# EasyEDA Pro project 2025-03-14.epro, board PCIex16_3
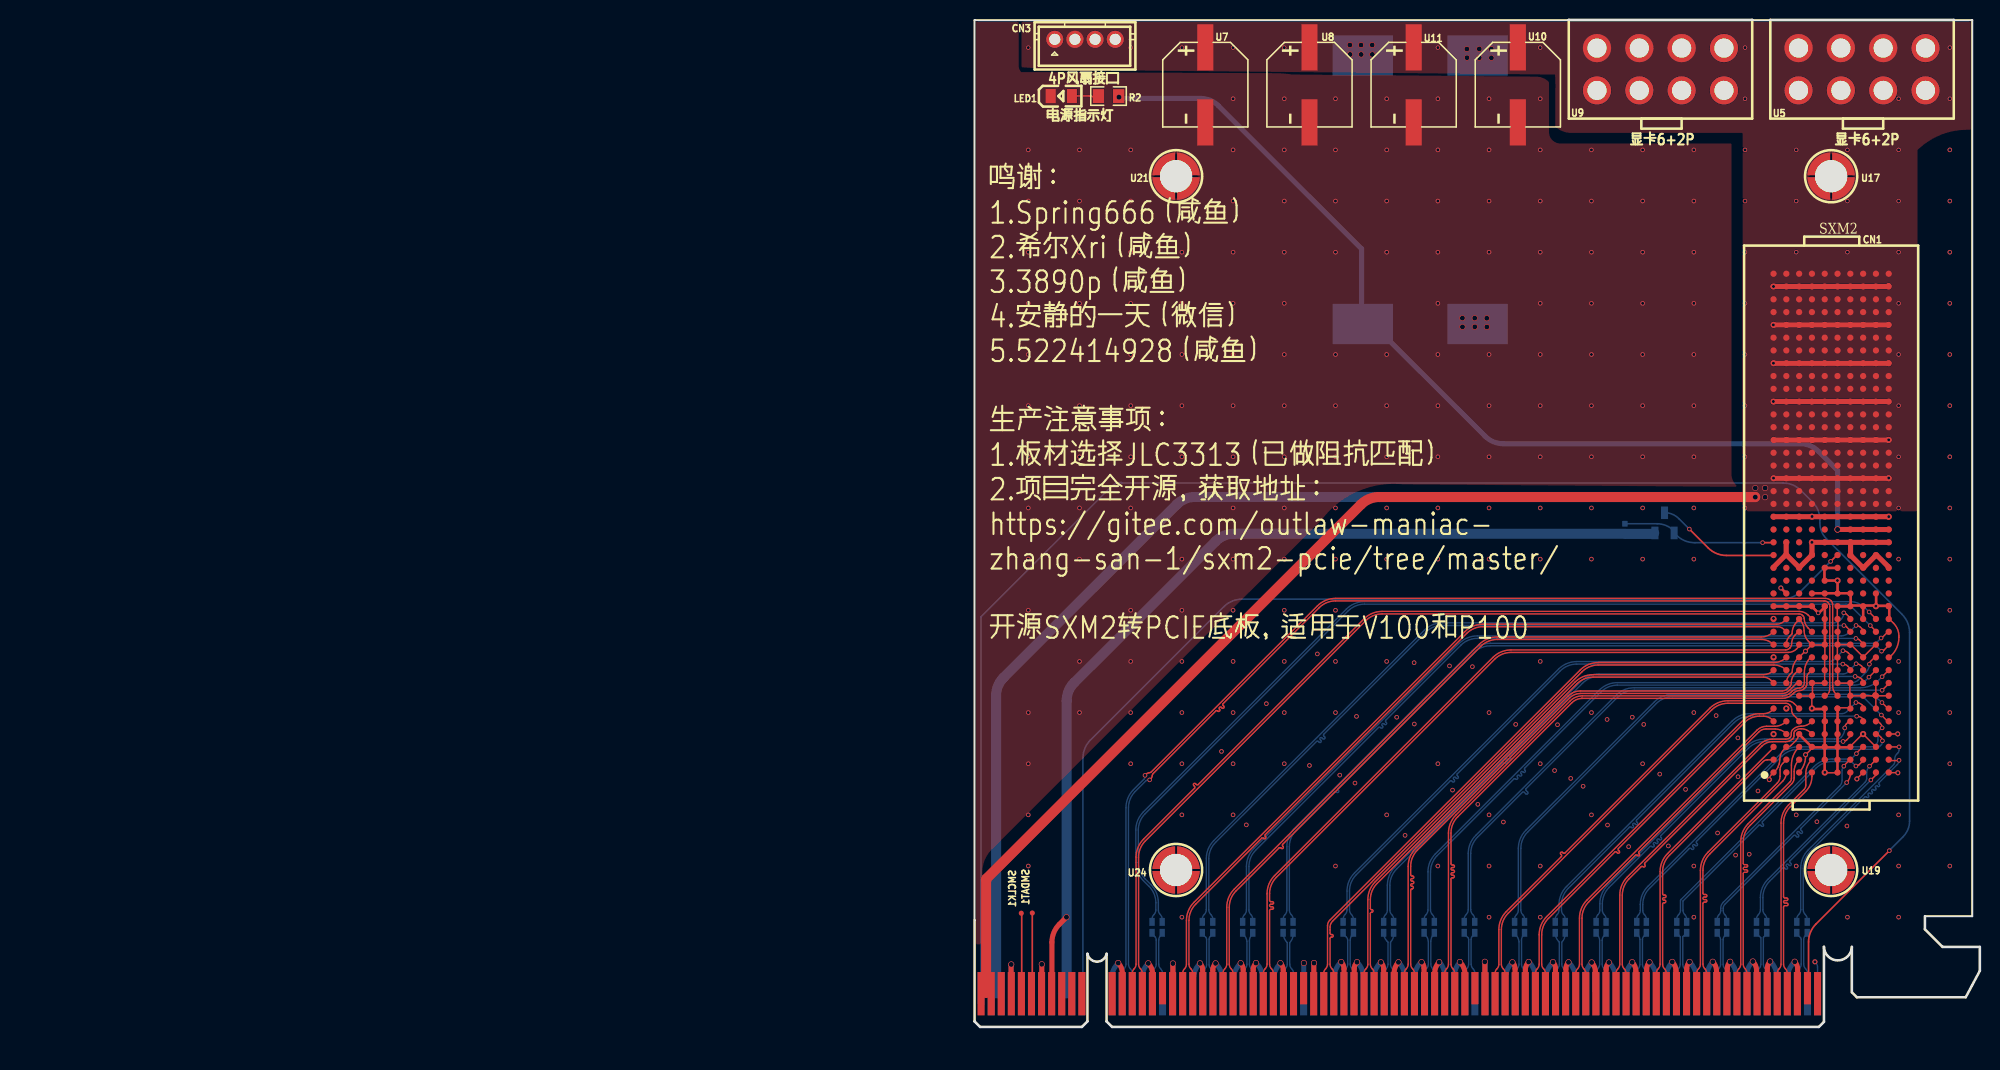
[diagram p1: board, top side]
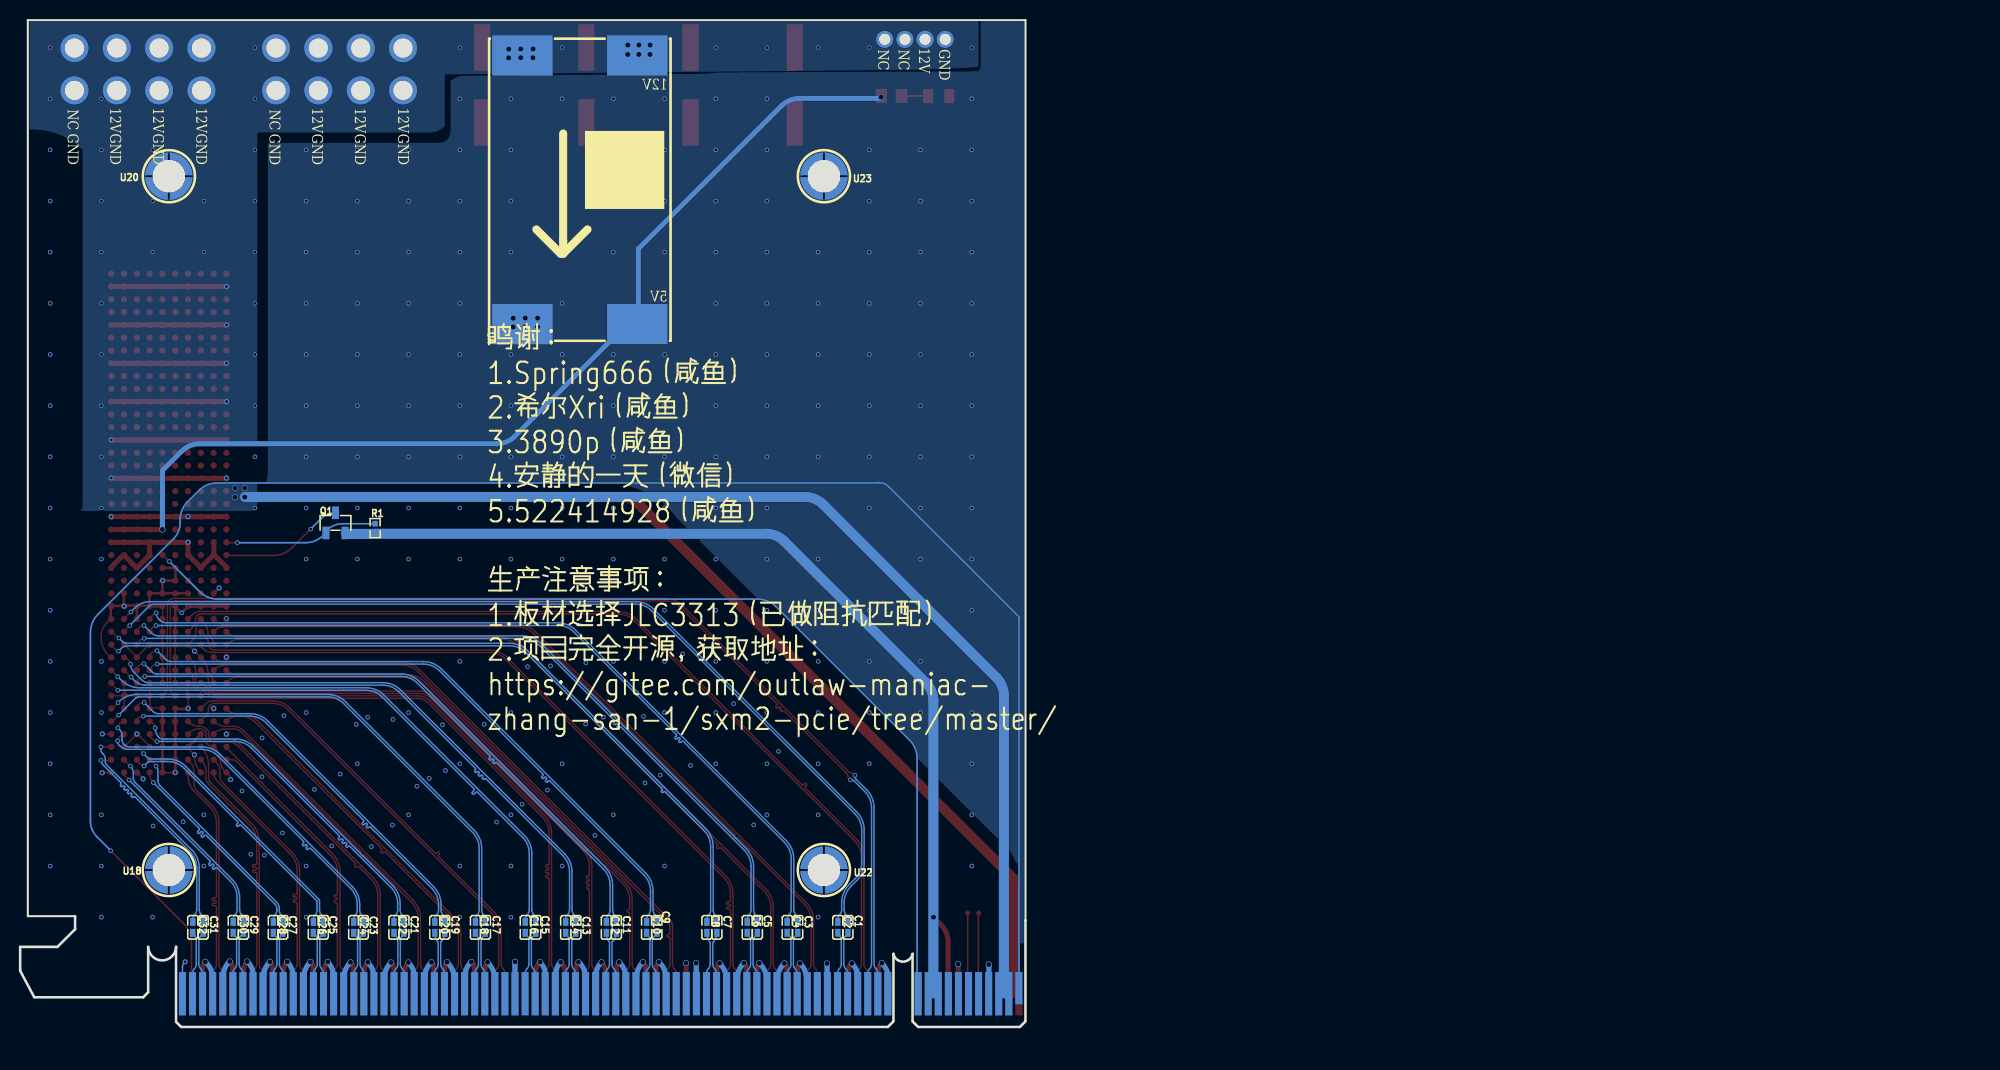
[diagram p2: board, bottom side, seen from below]

Outline 99.76 x 99.98 mm; copper layers: Top Layer, gnd1, gnd2, Bottom Layer. Coordinates in mm from the lower left corner of the outline.
Outline path: 0,10.63 0,99.98 99,99.98 99,11 94.31,11
Stack: Top Layer 0.035mm 外层铜厚1oz / Dielectric1 0.2104mm 7628 RC49% 8.6mil / gnd1 0.0152mm 内层铜厚 / Dielectric2 1.065mm 1.1mm H/HOZ Copper / gnd2 0.0152mm 内层铜厚 / Dielectric3 0.2104mm 7628 RC49% 8.6mil / Bottom Layer 0.035mm 外层铜厚1oz

## Design rules (mm)
net HSIP15_N: HSIP15_
net HSIP14_P: HSIP14_
net HSOP15_P: HSOP15_
net HSOP14_N: HSOP14_
net HSIP12_N: HSIP12_
net HSIP15_P: HSIP15_
net HSIP13_P: HSIP13_
net HSIP14_N: HSIP14_
net HSOP15_N: HSOP15_
net HSOP12_P: HSOP12_
net HSOP14_P: HSOP14_
net HSOP13_N: HSOP13_
net HSIP12_P: HSIP12_
net HSIP13_N: HSIP13_
net HSOP12_N: HSOP12_
net HSOP13_P: HSOP13_
net HSIP9_N: HSIP9_
net HSIP11_P: HSIP11_
net HSOP8_P: HSOP8_
net HSOP11_N: HSOP11_
net HSIP8_N: HSIP8_
net HSIP9_P: HSIP9_
net HSIP10_P: HSIP10_
net HSIP11_N: HSIP11_
net HSOP8_N: HSOP8_
net HSOP9_P: HSOP9_
net HSOP11_P: HSOP11_
net HSOP10_N: HSOP10_
net HSIP8_P: HSIP8_
net HSIP10_N: HSIP10_
net HSOP9_N: HSOP9_
net HSOP10_P: HSOP10_
net REFCLK_P: REFCLK_
net REFCLK_N: REFCLK_
net HSIP7_N: HSIP7_
net HSIP6_P: HSIP6_
net HSOP7_P: HSOP7_
net HSOP6_N: HSOP6_
net HSIP7_P: HSIP7_
net HSIP4_N: HSIP4_
net HSIP6_N: HSIP6_
net HSIP5_P: HSIP5_
net HSOP4_P: HSOP4_
net HSOP7_N: HSOP7_
net HSOP5_N: HSOP5_
net HSOP6_P: HSOP6_
net HSIP4_P: HSIP4_
net HSIP5_N: HSIP5_
net HSOP4_N: HSOP4_
net HSOP5_P: HSOP5_
net HSIP0_N: DP1
net HSIP3_P: HSIP3_
net HSOP1_P: HSOP1_
net HSOP3_N: HSOP3_
net HSIP0_P: DP1
net HSIP1_N: HSIP1_
net HSIP3_N: HSIP3_
net HSIP2_P: HSIP2_
net HSOP0_P: HSOP0_
net HSOP1_N: HSOP1_
net HSOP2_N: HSOP2_
net HSOP3_P: HSOP3_
net HSIP1_P: HSIP1_
net HSIP2_N: HSIP2_
net HSOP0_N: HSOP0_
net HSOP2_P: HSOP2_
net IP5+: IP5
net IP5-: IP5
net IP6+: IP6
net IP6-: IP6
net IP7-: IP7
net IP7+: IP7
net IP4-: IP4
net IP4+: IP4
net IP3-: IP3
net IP3+: IP3
net IP2-: IP2
net IP2+: IP2
net IP1-: IP1
net IP1+: IP1
net IP0-: IP0
net IP0+: IP0
net IP8+: IP8
net IP8-: IP8
net IP9+: IP9
net IP9-: IP9
net IP10+: IP10
net IP10-: IP10
net IP11+: IP11
net IP11-: IP11
net IP12+: IP12
net IP12-: IP12
net IP13+: IP13
net IP13-: IP13
net IP14+: IP14
net IP14-: IP14
net IP15+: IP15
net IP15-: IP15
template: 自定义配置
spacing copperThickness1oz (default): track to track 0.102, other pairs 0 to 2
track width 85ohm (default): min 0.127, default 0.254, max 1
track width 50ohm: min 0.16, default 0.16, max 1
track width power: min 0.5, default 0.5, max 2
track width def: min 0.127, default 0.14, max 2.54
differential pair 85ohm (default): width min 0.138, default 0.138, max 0.138; gap min 0.11, default 0.11
via viaSize (default): diameter min 0.45, default 0.45, max 10; hole min 0.3, default 0.3, max 6.299
net SMCLK uses 50ohm
net SMDAT uses 50ohm
net 12V uses power
net 12VGND uses def
net 5V uses power
net $1N108562 uses 50ohm
net PERST_N uses 50ohm
net $1N108568 uses 50ohm
net 3V3 uses power
net $1N101473 uses 50ohm
net $1N129529 uses 50ohm

## Placement (name value [footprint] x y rotation side)
C1  100nF  [C0402]  17.61 9.89 90 bottom
C2  100nF  [C0402]  18.62 9.89 90 bottom
C3  100nF  [C0402]  22.6 9.89 90 bottom
C4  100nF  [C0402]  23.64 9.89 90 bottom
C5  100nF  [C0402]  26.6 9.89 90 bottom
C6  100nF  [C0402]  27.61 9.89 90 bottom
C7  100nF  [C0402]  30.62 9.89 90 bottom
C8  100nF  [C0402]  31.61 9.89 90 bottom
C9  100nF  [C0402]  36.57 9.89 90 bottom
C10  100nF  [C0402]  37.6 9.89 90 bottom
C11  100nF  [C0402]  40.6 9.89 90 bottom
C12  100nF  [C0402]  41.59 9.89 90 bottom
C13  100nF  [C0402]  44.62 9.89 90 bottom
C14  100nF  [C0402]  45.63 9.89 90 bottom
C15  100nF  [C0402]  48.59 9.89 90 bottom
C16  100nF  [C0402]  49.63 9.89 90 bottom
C17  100nF  [C0402]  53.59 9.89 90 bottom
C18  100nF  [C0402]  54.58 9.89 90 bottom
C19  100nF  [C0402]  57.62 9.89 90 bottom
C20  100nF  [C0402]  58.61 9.89 90 bottom
C21  100nF  [C0402]  61.68 9.89 90 bottom
C22  100nF  [C0402]  62.67 9.89 90 bottom
C23  100nF  [C0402]  65.71 9.89 90 bottom
C24  100nF  [C0402]  66.66 9.89 90 bottom
C25  100nF  [C0402]  69.69 9.89 90 bottom
C26  100nF  [C0402]  70.66 9.89 90 bottom
C27  100nF  [C0402]  73.7 9.89 90 bottom
C28  100nF  [C0402]  74.63 9.89 90 bottom
C29  100nF  [C0402]  77.59 9.89 90 bottom
C30  100nF  [C0402]  78.62 9.89 90 bottom
C31  100nF  [C0402]  81.59 9.89 90 bottom
C32  100nF  [C0402]  82.63 9.89 90 bottom
CN1  84740-102LF  [CONN-SMD_400P-P1.27_84740-002LF]  85 50.04 270 top
CN3  WAFER-PH2.0-4PZZ  [CONN-TH_4P-P2.00_FWF20001-S04S22W5B]  10.96 98.08 0 top
J3  PCIEx16  [pciex16_金手指_有边框]  0.65 3.3 0 top
LED1  NCD0805R1  [LED0805-R-RD]  8.61 92.44 0 top
Q1  AO3400A  [SOT-23-3_L2.9-W1.3-P1.90-LS2.4-BR]  68.47 50.06 270 bottom
R1  10kΩ  [R0402]  64.54 49.54 270 bottom
R2  10kΩ  [R0805]  13.3 92.44 180 top
SMCLK1  -  [Test-Point-0.5mm]  4.64 11.29 90 bottom
SMDAT1  -  [Test-Point-0.5mm]  5.73 11.31 90 bottom
U4  mini5605V5A输出电源模块  [COMM-SMD_MINI5605V5A]  44.22 83.14 270 bottom
U5  显卡8P一体直针座黑色  [CONN-TH_5557-2-4P]  88.07 95.11 0 top
U7  16V470UF  [CAP-SMD_BD8.0-L8.3-W8.3-LS9.3-FD]  22.9 93.55 270 top
U8  16V470UF  [CAP-SMD_BD8.0-L8.3-W8.3-LS9.3-FD]  33.24 93.55 270 top
U9  显卡8P一体直针座黑色  [CONN-TH_5557-2-4P]  68.07 95.11 0 top
U10  16V470UF  [CAP-SMD_BD8.0-L8.3-W8.3-LS9.3-FD]  53.91 93.55 270 top
U11  16V470UF  [CAP-SMD_BD8.0-L8.3-W8.3-LS9.3-FD]  43.57 93.55 270 top
U17  铜柱M3*5+6  [SMD_BD4.2-L4.7-W4.7-D3.0]  85 84.48 0 top
U18  铜柱M3*5+6  [SMD_BD4.2-L4.7-W4.7-D3.0]  85 15.58 180 bottom
U19  铜柱M3*5+6  [SMD_BD4.2-L4.7-W4.7-D3.0]  85 15.58 0 top
U20  铜柱M3*5+6  [SMD_BD4.2-L4.7-W4.7-D3.0]  85 84.48 180 bottom
U21  铜柱M3*5+6  [SMD_BD4.2-L4.7-W4.7-D3.0]  20 84.48 0 top
U22  铜柱M3*5+6  [SMD_BD4.2-L4.7-W4.7-D3.0]  20 15.58 180 bottom
U23  铜柱M3*5+6  [SMD_BD4.2-L4.7-W4.7-D3.0]  20 84.48 180 bottom
U24  铜柱M3*5+6  [SMD_BD4.2-L4.7-W4.7-D3.0]  20 15.58 0 top

## Footprints (pads in the part's own frame, mm; a bottom-side part is the same pattern mirrored in y, then rotated)
C0402
  rect 0.79x0.54 smd: 1(-0.545,0) 2(0.545,0)
CAP-SMD_BD8.0-L8.3-W8.3-LS9.3-FD
  rect 4.6x1.6 smd: 1(-3.724,0) 2(3.724,0)
COMM-SMD_MINI5605V5A
  rect 4x6 smd: 1(-13.335,5.7) 2(-13.335,-5.7) 3(13.335,5.7) 4(13.335,-5.7)
CONN-SMD_400P-P1.27_84740-002LF
  round 0.623 smd: A1(24.765,-5.715) A2(23.495,-5.715) A3(22.225,-5.715) A4(20.955,-5.715) A5(19.685,-5.715) A6(18.415,-5.715) A8(15.875,-5.715) A9(14.605,-5.715) A10(13.335,-5.715) A11(12.065,-5.715) A12(10.795,-5.715) A13(9.525,-5.715) A14(8.255,-5.715) A15(6.985,-5.715) A16(5.715,-5.715) A17(4.445,-5.715) A18(3.175,-5.715) A19(1.905,-5.715) A20(0.635,-5.715) A21(-0.635,-5.715) A22(-1.905,-5.715) A23(-3.175,-5.715) A24(-4.445,-5.715) A25(-5.715,-5.715) A26(-6.985,-5.715) A27(-8.255,-5.715) A28(-9.525,-5.715) A29(-10.795,-5.715) A30(-12.065,-5.715) A31(-13.335,-5.715) A32(-14.605,-5.715) A33(-15.875,-5.715) A34(-17.145,-5.715) A35(-18.415,-5.715) A36(-19.685,-5.715) A37(-20.955,-5.715) A38(-22.225,-5.715) A39(-23.495,-5.715) A40(-24.765,-5.715) B1(24.765,-4.445) B2(23.495,-4.445) B3(22.225,-4.445) B4(20.955,-4.445) B5(19.685,-4.445) B6(18.415,-4.445) B8(15.875,-4.445) B9(14.605,-4.445) B10(13.335,-4.445) B11(12.065,-4.445) B12(10.795,-4.445) B13(9.525,-4.445) B14(8.255,-4.445) B15(6.985,-4.445) B16(5.715,-4.445) B17(4.445,-4.445) B18(3.175,-4.445) B19(1.905,-4.445) B20(0.635,-4.445) B21(-0.635,-4.445) B22(-1.905,-4.445) B23(-3.175,-4.445) B24(-4.445,-4.445) B25(-5.715,-4.445) B26(-6.985,-4.445) B27(-8.255,-4.445) B28(-9.525,-4.445) B29(-10.795,-4.445) B30(-12.065,-4.445) B31(-13.335,-4.445) B32(-14.605,-4.445) B33(-15.875,-4.445) B34(-17.145,-4.445) B35(-18.415,-4.445) B36(-19.685,-4.445) B37(-20.955,-4.445) B38(-22.225,-4.445) B39(-23.495,-4.445) B40(-24.765,-4.445) C1(24.765,-3.175) C2(23.495,-3.175) C3(22.225,-3.175) C4(20.955,-3.175) C5(19.685,-3.175) C6(18.415,-3.175) C7(17.145,-3.175) C8(15.875,-3.175) C9(14.605,-3.175) C10(13.335,-3.175) C11(12.065,-3.175) C12(10.795,-3.175) C13(9.525,-3.175) C14(8.255,-3.175) C15(6.985,-3.175) C16(5.715,-3.175) C17(4.445,-3.175) C18(3.175,-3.175) C19(1.905,-3.175) C20(0.635,-3.175) C21(-0.635,-3.175) C22(-1.905,-3.175) C23(-3.175,-3.175) C24(-4.445,-3.175) C25(-5.715,-3.175) C26(-6.985,-3.175) C27(-8.255,-3.175) C28(-9.525,-3.175) C29(-10.795,-3.175) C30(-12.065,-3.175) C31(-13.335,-3.175) C32(-14.605,-3.175) C33(-15.875,-3.175) C34(-17.145,-3.175) C35(-18.415,-3.175) C36(-19.685,-3.175) C37(-20.955,-3.175) C38(-22.225,-3.175) C39(-23.495,-3.175) C40(-24.765,-3.175) D1(24.765,-1.905) D2(23.495,-1.905) D3(22.225,-1.905) D4(20.955,-1.905) D5(19.685,-1.905) D6(18.415,-1.905) D7(17.145,-1.905) D8(15.875,-1.905) D9(14.605,-1.905) D10(13.335,-1.905) D11(12.065,-1.905) D12(10.795,-1.905) D13(9.525,-1.905) D14(8.255,-1.905) D15(6.985,-1.905) D16(5.715,-1.905) D17(4.445,-1.905) D18(3.175,-1.905) D19(1.905,-1.905) D20(0.635,-1.905) D21(-0.635,-1.905) D22(-1.905,-1.905) D23(-3.175,-1.905) D24(-4.445,-1.905) D25(-5.715,-1.905) D26(-6.985,-1.905) D27(-8.255,-1.905) D28(-9.525,-1.905) D29(-10.795,-1.905) D30(-12.065,-1.905) D31(-13.335,-1.905) D32(-14.605,-1.905) D33(-15.875,-1.905) D34(-17.145,-1.905) D35(-18.415,-1.905) D36(-19.685,-1.905) D37(-20.955,-1.905) D38(-22.225,-1.905) D39(-23.495,-1.905) D40(-24.765,-1.905) E1(24.765,-0.635) E2(23.495,-0.635) E3(22.225,-0.635) E4(20.955,-0.635) E5(19.685,-0.635) E6(18.415,-0.635) E7(17.145,-0.635) E8(15.875,-0.635) E9(14.605,-0.635) E10(13.335,-0.635) E11(12.065,-0.635) E12(10.795,-0.635) E13(9.525,-0.635) E14(8.255,-0.635) E15(6.985,-0.635) E16(5.715,-0.635) E17(4.445,-0.635) E18(3.175,-0.635) E19(1.905,-0.635) E20(0.635,-0.635) E21(-0.635,-0.635) E22(-1.905,-0.635) E23(-3.175,-0.635) E24(-4.445,-0.635) E25(-5.715,-0.635) E26(-6.985,-0.635) E27(-8.255,-0.635) E28(-9.525,-0.635) E29(-10.795,-0.635) E30(-12.065,-0.635) E31(-13.335,-0.635) E32(-14.605,-0.635) E33(-15.875,-0.635) E34(-17.145,-0.635) E35(-18.415,-0.635) E36(-19.685,-0.635) E37(-20.955,-0.635) E38(-22.225,-0.635) E39(-23.495,-0.635) E40(-24.765,-0.635) F1(24.765,0.635) F2(23.495,0.635) F3(22.225,0.635) F4(20.955,0.635) F5(19.685,0.635) F6(18.415,0.635) F7(17.145,0.635) F8(15.875,0.635) F9(14.605,0.635) F10(13.335,0.635) F11(12.065,0.635) F12(10.795,0.635) F13(9.525,0.635) F14(8.255,0.635) F15(6.985,0.635) F16(5.715,0.635) F17(4.445,0.635) F18(3.175,0.635) F19(1.905,0.635) F20(0.635,0.635) F21(-0.635,0.635) F22(-1.905,0.635) F23(-3.175,0.635) F24(-4.445,0.635) F25(-5.715,0.635) F26(-6.985,0.635) F27(-8.255,0.635) F28(-9.525,0.635) F29(-10.795,0.635) F30(-12.065,0.635) F31(-13.335,0.635) F32(-14.605,0.635) F33(-15.875,0.635) F34(-17.145,0.635) F35(-18.415,0.635) F36(-19.685,0.635) F37(-20.955,0.635) F38(-22.225,0.635) F39(-23.495,0.635) F40(-24.765,0.635) G1(24.765,1.905) G2(23.495,1.905) G3(22.225,1.905) G4(20.955,1.905) G5(19.685,1.905) G6(18.415,1.905) G7(17.145,1.905) G8(15.875,1.905) G9(14.605,1.905) G10(13.335,1.905) G11(12.065,1.905) G12(10.795,1.905) G13(9.525,1.905) G14(8.255,1.905) G15(6.985,1.905) G16(5.715,1.905) G17(4.445,1.905) G18(3.175,1.905) G19(1.905,1.905) G20(0.635,1.905) G21(-0.635,1.905) G22(-1.905,1.905) G23(-3.175,1.905) G24(-4.445,1.905) G25(-5.715,1.905) G26(-6.985,1.905) G27(-8.255,1.905) G28(-9.525,1.905) G29(-10.795,1.905) G30(-12.065,1.905) G31(-13.335,1.905) G32(-14.605,1.905) G33(-15.875,1.905) G34(-17.145,1.905) G35(-18.415,1.905) G36(-19.685,1.905) G37(-20.955,1.905) G38(-22.225,1.905) G39(-23.495,1.905) G40(-24.765,1.905) H1(24.765,3.175) H2(23.495,3.175) H3(22.225,3.175) H4(20.955,3.175) H5(19.685,3.175) H6(18.415,3.175) H7(17.145,3.175) H8(15.875,3.175) H9(14.605,3.175) H10(13.335,3.175) H11(12.065,3.175) H12(10.795,3.175) H13(9.525,3.175) H14(8.255,3.175) H15(6.985,3.175) H16(5.715,3.175) H17(4.445,3.175) H18(3.175,3.175) H19(1.905,3.175) H20(0.635,3.175) H21(-0.635,3.175) H22(-1.905,3.175) H23(-3.175,3.175) H24(-4.445,3.175) H25(-5.715,3.175) H26(-6.985,3.175) H27(-8.255,3.175) H28(-9.525,3.175) H29(-10.795,3.175) H30(-12.065,3.175) H31(-13.335,3.175) H32(-14.605,3.175) H33(-15.875,3.175) H34(-17.145,3.175) H35(-18.415,3.175) H36(-19.685,3.175) H37(-20.955,3.175) H38(-22.225,3.175) H39(-23.495,3.175) H40(-24.765,3.175) J1(24.765,4.445) J2(23.495,4.445) J3(22.225,4.445) J4(20.955,4.445) J5(19.685,4.445) J6(18.415,4.445) J7(17.145,4.445) J8(15.875,4.445) J9(14.605,4.445) J10(13.335,4.445) J11(12.065,4.445) J12(10.795,4.445) J13(9.525,4.445) J14(8.255,4.445) J15(6.985,4.445) J16(5.715,4.445) J17(4.445,4.445) J18(3.175,4.445) J19(1.905,4.445) J20(0.635,4.445) J21(-0.635,4.445) J22(-1.905,4.445) J23(-3.175,4.445) J24(-4.445,4.445) J25(-5.715,4.445) J26(-6.985,4.445) J27(-8.255,4.445) J28(-9.525,4.445) J29(-10.795,4.445) J30(-12.065,4.445) J31(-13.335,4.445) J32(-14.605,4.445) J33(-15.875,4.445) J34(-17.145,4.445) J35(-18.415,4.445) J36(-19.685,4.445) J37(-20.955,4.445) J38(-22.225,4.445) J39(-23.495,4.445) J40(-24.765,4.445) K1(24.765,5.715) K2(23.495,5.715) K3(22.225,5.715) K4(20.955,5.715) K5(19.685,5.715) K6(18.415,5.715) K7(17.145,5.715) K8(15.875,5.715) K9(14.605,5.715) K10(13.335,5.715) K11(12.065,5.715) K12(10.795,5.715) K13(9.525,5.715) K14(8.255,5.715) K15(6.985,5.715) K16(5.715,5.715) K17(4.445,5.715) K18(3.175,5.715) K19(1.905,5.715) K20(0.635,5.715) K21(-0.635,5.715) K22(-1.905,5.715) K23(-3.175,5.715) K24(-4.445,5.715) K25(-5.715,5.715) K26(-6.985,5.715) K27(-8.255,5.715) K28(-9.525,5.715) K29(-10.795,5.715) K30(-12.065,5.715) K31(-13.335,5.715) K32(-14.605,5.715) K33(-15.875,5.715) K34(-17.145,5.715) K35(-18.415,5.715) K36(-19.685,5.715) K37(-20.955,5.715) K38(-22.225,5.715) K39(-23.495,5.715) K40(-24.765,5.715)
CONN-TH_4P-P2.00_FWF20001-S04S22W5B
  round 1.7 hole 1.1: 1(-3,0) 2(-1,0) 3(1,0) 4(3,0)
CONN-TH_5557-2-4P
  round 2.8 hole 1.9: 1(-6.3,2.1) 2(-2.1,2.1) 3(2.1,2.1) 4(6.3,2.1) 5(6.3,-2.1) 6(2.1,-2.1) 7(-2.1,-2.1) 8(-6.3,-2.1)
LED0805-R-RD
  rect 1x1.399 smd: 1(1.05,0) 2(-1.05,0)
pciex16_金手指_有边框
  rect 0.7x3.2 smd far side: A1(0.001,0.55)
  rect 0.7x4.3 smd far side: A2(1,0) A3(2.001,0) A4(3,0) A5(4,0) A6(5,0) A7(6,0) A8(7,0) A9(8,0) A10(9,0) A11(10,0) A12(13,0) A13(14,0) A14(15,0) A15(16,0) A16(17,0) A17(18,0) A18(19,0) A19(20,0) A20(21,0) A21(22,0) A22(23,0) A23(24,0) A24(25,0) A25(26,0) A26(27,0) A27(28,0) A28(29,0) A29(30,0) A30(31,0) A31(32.001,0) A32(33.001,0) A33(34.001,0) A34(35.001,0) A35(36.001,0) A36(37,0) A37(38,0) A38(39.001,0) A39(40.001,0) A40(41.001,0) A41(42.001,0) A42(43.001,0) A43(44.001,0) A44(45,0) A45(46,0) A46(47,0) A47(48,0) A48(49,0) A49(50,0) A50(51.001,0) A51(52.001,0) A52(53.001,0) A53(54.001,0) A54(55.001,0) A55(56.001,0) A56(57.001,0) A57(58.001,0) A58(59.001,0) A59(60.001,0) A60(61.001,0) A61(62.001,0) A62(63.001,0) A63(64.001,0) A64(65,0) A65(66,0) A66(67,0) A67(68.001,0) A68(69.001,0) A69(70.001,0) A70(71.001,0) A71(72.001,0) A72(73.001,0) A73(74.001,0) A74(75.001,0) A75(76.001,0) A76(77.001,0) A77(78.001,0) A78(79.001,0) A79(80.001,0) A80(81.001,0) A81(82.001,0) A82(83,0)
  rect 0.7x4.3 smd: B1(0.001,0) B2(1,0) B3(2.001,0) B4(3,0) B5(4,0) B6(5,0) B7(6,0) B8(7,0) B9(8,0) B10(9,0) B11(10,0) B12(13,0) B13(14,0) B14(15,0) B15(16,0) B16(17,0) B18(19,0) B19(20,0) B20(21,0) B21(22,0) B22(23,0) B23(24,0) B24(25,0) B25(26,0) B26(27,0) B27(28,0) B28(29,0) B29(30,0) B30(31,0) B32(33.001,0) B33(34.001,0) B34(35.001,0) B35(36.001,0) B36(37,0) B37(38,0) B38(39.001,0) B39(40.001,0) B40(41.001,0) B41(42.001,0) B42(43.001,0) B43(44.001,0) B44(45,0) B45(46,0) B46(47,0) B47(48,0) B49(50,0) B50(51.001,0) B51(52.001,0) B52(53.001,0) B53(54.001,0) B54(55.001,0) B55(56.001,0) B56(57.001,0) B57(58.001,0) B58(59.001,0) B59(60.001,0) B60(61.001,0) B61(62.001,0) B62(63.001,0) B63(64.001,0) B64(65,0) B65(66,0) B66(67,0) B67(68.001,0) B68(69.001,0) B69(70.001,0) B70(71.001,0) B71(72.001,0) B72(73.001,0) B73(74.001,0) B74(75.001,0) B75(76.001,0) B76(77.001,0) B77(78.001,0) B78(79.001,0) B79(80.001,0) B80(81.001,0) B82(83,0)
  rect 0.7x3.2 smd: B17(18,0.55) B31(32.001,0.55) B48(49,0.55) B81(82.001,0.55)
R0402
  rect 0.566x0.54 smd: 1(-0.433,0) 2(0.433,0)
R0805
  rect 1.133x1.377 smd: 1(-1,0) 2(1,0)
SMD_BD4.2-L4.7-W4.7-D3.0
  custom 2.25x2.25 smd: 1(-1.225,1.443) 1(-1.225,-1.442) 1(1.225,1.443) 1(1.225,-1.443)
SOT-23-3_L2.9-W1.3-P1.90-LS2.4-BR
  rect 1.25x0.7 smd: 1(1,-0.95) 2(1,0.95) 3(-1,0)
Test-Point-0.5mm
  round 0.5 smd far side: 1(0,0)

## Nets
As in the schematic, except:
12VGND: CN1.A1 CN1.A4 CN1.A10 CN1.A13 CN1.A14 CN1.A17 CN1.A21 CN1.A24 CN1.A27 CN1.A30 CN1.A33 CN1.A36 CN1.A39 CN1.B3 CN1.B6 CN1.B8 CN1.B11 CN1.B14 CN1.B15 CN1.B18 CN1.B19 CN1.B21 CN1.B24 CN1.B27 CN1.B30 CN1.B33 CN1.B36 CN1.B39 CN1.C1 CN1.C4 CN1.C7 CN1.C10 CN1.C13 CN1.C14 CN1.C17 CN1.C21 CN1.C24 CN1.C27 CN1.C30 CN1.C33 CN1.C36 CN1.C39 CN1.D3 CN1.D6 CN1.D7 CN1.D8 CN1.D11 CN1.D14 CN1.D15 CN1.D18 CN1.D19 CN1.D21 CN1.D24 CN1.D27 CN1.D30 CN1.D33 CN1.D36 CN1.D39 CN1.E1 CN1.E2 CN1.E3 CN1.E4 CN1.E5 CN1.E6 CN1.E8 CN1.E9 CN1.E10 CN1.E11 CN1.E12 CN1.E13 CN1.E14 CN1.E15 CN1.E16 CN1.E17 CN1.E19 CN1.E21 CN1.E24 CN1.E27 CN1.E30 CN1.E33 CN1.E36 CN1.E39 CN1.F1 CN1.F2 CN1.F3 CN1.F4 CN1.F5 CN1.F6 CN1.F8 CN1.F9 CN1.F10 CN1.F11 CN1.F12 CN1.F13 CN1.F14 CN1.F15 CN1.F16 CN1.F17 CN1.F19 CN1.F21 CN1.F24 CN1.F27 CN1.F30 CN1.F33 CN1.F36 CN1.F39 CN1.G3 CN1.G6 CN1.G7 CN1.G8 CN1.G11 CN1.G14 CN1.G15 CN1.G18 CN1.G19 CN1.G21 CN1.G24 CN1.G27 CN1.G30 CN1.G33 CN1.G36 CN1.G39 CN1.H1 CN1.H4 CN1.H7 CN1.H10 CN1.H13 CN1.H14 CN1.H17 CN1.H19 CN1.H21 CN1.H24 CN1.H27 CN1.H30 CN1.H33 CN1.H36 CN1.H39 CN1.J3 CN1.J6 CN1.J7 CN1.J8 CN1.J11 CN1.J14 CN1.J15 CN1.J18 CN1.J19 CN1.J21 CN1.J24 CN1.J27 CN1.J30 CN1.J33 CN1.J36 CN1.J39 CN1.K1 CN1.K4 CN1.K7 CN1.K10 CN1.K13 CN1.K14 CN1.K17 CN1.K19 CN1.K21 CN1.K24 CN1.K27 CN1.K30 CN1.K33 CN1.K36 CN1.K39 CN3.1 J3.A4 J3.A12 J3.A15 J3.A18 J3.A20 J3.A23 J3.A24 J3.A27 J3.A28 J3.A31 J3.A34 J3.A37 J3.A38 J3.A41 J3.A42 J3.A45 J3.A46 J3.A49 J3.A51 J3.A54 J3.A55 J3.A58 J3.A59 J3.A62 J3.A63 J3.A66 J3.A67 J3.A70 J3.A71 J3.A74 J3.A75 J3.A78 J3.A79 J3.A82 J3.B4 J3.B7 J3.B13 J3.B16 J3.B18 J3.B21 J3.B22 J3.B25 J3.B26 J3.B29 J3.B32 J3.B35 J3.B36 J3.B39 J3.B40 J3.B43 J3.B44 J3.B47 J3.B49 J3.B52 J3.B53 J3.B56 J3.B57 J3.B60 J3.B61 J3.B64 J3.B65 J3.B68 J3.B69 J3.B72 J3.B73 J3.B76 J3.B77 J3.B80 LED1.2 U4.2 U4.4 U5.5 U5.6 U5.7 U5.8 U7.2 U8.2 U9.5 U9.6 U9.7 U9.8 U10.2 U11.2

Pads without a net: CN1 A15 A16 A20 B16 B17 B20 C15 C16 C18 C19 C20 D16 D17 D20 E18 E20 G16 G17 H15 H16 H18 J16 J17 K15 K16 K18; CN3 3 4; J3 A5 A6 A7 A8 A19 A32 A33 A50 B3 B9 B10 B11 B12 B17 B30 B31 B48 B82; U5 4; U9 4; U17 1; U18 1; U19 1; U20 1; U21 1; U22 1; U23 1; U24 1

## Via types
v1: diameter 0.6, hole 0.5, Top Layer to Bottom Layer, 60 vias
v2: diameter 0.45, hole 0.3, Top Layer to Bottom Layer, 312 vias
v3: diameter 0.5, hole 0.3, Top Layer to Bottom Layer, 26 vias

## Routing (per net, layer and track width the routed paths; a pad name or vN(x,y) marks a point on that pad's centre or on a via; arc(x,y) is an arc through that point)
3V3: length 103.8
  Top Layer w0.5: v1(9.12,10.89) 8.42,10.19 arc(7.87,9.37) 7.68,8.4 7.68,3.3
  Bottom Layer w0.5: 8.53,3.31 9.62,3.31 ; 64.47,49.1 arc(64.5,49.1) 64.52,49.08
  Bottom Layer w1: 64.63,48.96 67.34,48.96 67.44,49.05 ; 9.14,3.34 9.14,32.38 arc(9.33,33.35) 9.88,34.18 23.94,48.23 arc(24.76,48.78) 25.73,48.98 64.51,48.98
5V: length 101
  Top Layer w0.5: 90.75,49.39 89.52,49.39 arc(89.49,49.4) 89.47,49.41 ; v1(85.64,49.4) 89.44,49.4
  Bottom Layer w0.5: 14.4,92.21 22.42,92.21 arc(23.39,92.02) 24.21,91.47 38.41,77.27 38.41,70.16 ; v1(85.64,49.4) 85.64,55.26 83.73,57.17 arc(82.91,57.72) 81.94,57.92 52.46,57.92 arc(51.49,58.11) 50.67,58.66 40.49,68.84 arc(39.66,69.39) 38.69,69.58 38.39,69.58
  vias: v1(14.33,92.34)
12V: length 218.6
  Top Layer w0.5: J3.B1 1.66,3.3 arc(1.66,3.3) 1.67,3.3
  Top Layer w1: 1.15,3.37 1.15,14.64 arc(1.16,14.69) 1.18,14.72 38.35,51.88 arc(39.17,52.43) 40.14,52.63 77.45,52.63 arc(77.46,52.63) 77.46,52.62
  Bottom Layer w0.5: 1.67,3.34 2.51,3.34 arc(2.53,3.33) 2.54,3.32
  Bottom Layer w1: 77.43,52.63 21.87,52.63 arc(20.9,52.43) 20.07,51.88 2.88,34.69 arc(2.33,33.87) 2.14,32.9 2.14,3.34
  vias: v1(37.25,97.51) v1(37.26,96.58) v1(38.35,97.51) v1(38.37,96.58) v1(39.46,97.51) v1(39.47,96.58) v1(77.47,53.52) v1(77.47,52.62) v1(78.45,53.52) v1(78.45,52.61)
12VGND: length 409.4
  Top Layer w0.14: 82.46,27.02 82.46,27.02 ; 82.46,27.02 82.89,27.45 arc(83,27.61) 83.03,27.79 ; 82.46,27.02 82.46,26.87 arc(82.29,25.99) 81.79,25.24 ; 82.46,27.02 v3(82.46,27.03) ; 88.19,25.28 87.57,24.66 arc(87.56,24.65) v3(87.56,24.63) ; 84.34,34.14 83.15,34.14 83.15,33.2 arc(83.12,33.02) 83.02,32.86 ; 81.85,36.76 81.72,36.64 arc(81.29,35.99) 81.14,35.23 80.91,35 arc(80.66,34.62) 80.57,34.18 ; 84.36,36.73 84.36,34.25 arc(84.37,34.19) 84.41,34.13 ; 85.65,35.5 85.65,34.32 arc(85.64,34.28) 85.62,34.24 ; 81.83,32.86 82.99,32.86 arc(83,32.86) 83.02,32.86 ; 90.71,25.25 91.58,25.25 arc(91.6,25.25) v3(91.62,25.24) ; 79.3,25.27 79.06,25.03 arc(78.92,24.81) v3(78.87,24.56) ; 84.34,25.24 85.67,25.24 ; 86.87,31.7 85.66,31.7 arc(85.62,31.69) 85.59,31.67 ; 89.43,34.13 89.43,32.89 ; 88.16,29.09 89.4,27.86 arc(89.42,27.82) 89.43,27.77 ; 81.8,29.17 81.8,29.16 arc(81.79,29.12) 81.79,29.08 arc(81.7,28.72) 81.49,28.42 81.04,27.97 arc(80.83,27.83) 80.58,27.78 ; 90.78,36.68 90.98,36.88 arc(91.53,37.71) 91.72,38.68 91.72,38.82 arc(91.59,39.5) 91.2,40.08 90.81,40.47 ; 90.72,29.09 v3(91.6,29.09) ; 86.96,37.97 87.02,37.97 arc(87.06,37.96) 87.1,37.93 ; 86.96,37.97 88.06,36.87 arc(88.14,36.75) 88.17,36.6 ; 86.96,37.97 85.66,37.97 ; 86.96,37.97 86.91,38.01 ; 86.88,32.89 86.88,31.69 arc(86.87,31.68) 86.87,31.67 ; 83.09,37.95 82.42,37.28 arc(82.42,37.28) 82.42,37.27 ; 83.09,37.95 82.76,38.28 arc(82.43,38.77) 82.32,39.35 arc(82.2,39.96) 81.85,40.48 ; 83.09,37.95 83.13,37.91 ; 83.09,37.95 83.13,37.99 ; 85.63,37.97 85.66,37.97 ; 85.66,37.97 arc(85.67,37.98) 85.68,38 85.68,40.41 ; 85.59,34.13 86.75,34.13 arc(86.85,34.15) 86.93,34.21 ; 88.17,36.71 89.37,37.92 arc(89.39,37.95) 89.4,38 ; 86.86,34.15 86.86,32.84 ; 86.93,27.89 88.02,28.98 arc(88.09,29.03) 88.17,29.05 ; 81.81,36.7 82.39,37.28 arc(82.41,37.29) 82.43,37.29 ; 85.63,36.83 85.63,36.8 ; 85.63,36.8 85.63,35.58 arc(85.64,35.54) 85.66,35.5 ; 85.63,36.8 arc(85.64,36.78) 85.65,36.77 ; 85.63,36.8 arc(85.62,36.82) 85.62,36.84 85.62,37.97 ; 81.84,40.5 81.84,40.5 arc(81.85,40.49) 81.85,40.48 ; 81.85,40.48 81.63,40.26 arc(81.25,39.7) 81.12,39.04 80.89,38.81 arc(80.64,38.43) 80.54,37.97 ; 81.85,40.48 81.87,40.5 ; 89.43,32.88 89.43,31.69 ; 89.43,32.88 86.91,32.88 ; 89.43,32.88 90.6,32.88 arc(90.66,32.89) 90.7,32.92 ; 85.61,41.71 85.61,40.57 arc(85.63,40.49) 85.68,40.43 ; 83.12,37.93 84.3,37.93 arc(84.34,37.94) 84.38,37.96 84.38,36.91 arc(84.36,36.8) 84.29,36.71 ; 80.55,27.8 80.34,27.59 arc(80.01,27.1) 79.9,26.53 arc(79.89,26.32) 79.84,26.1 arc(79.77,25.95) 79.72,25.78 arc(79.59,25.57) 79.43,25.39 79.26,25.22 ; 83.15,31.62 arc(83.1,31.7) 83.09,31.79 83.09,32.9 arc(83.05,32.88) 83.02,32.86 ; 83.02,32.86 arc(83.01,32.86) 83.01,32.85 ; 83.04,34.14 arc(83,34.15) 82.96,34.17
  Top Layer w0.254: v3(80.01,43.59) 80.4,43.2 arc(80.43,43.15) 80.44,43.09 ; 89.5,41.82 90.73,41.82 arc(90.74,41.82) 90.76,41.83 ; 83.09,41.74 83.13,41.74 arc(83.2,41.73) 83.25,41.7 ; 83.09,41.74 81.82,41.74 ; 83.09,41.74 83.69,41.14 arc(83.7,41.12) 83.71,41.1 ; 83.09,41.74 83.07,41.76 ; 84.36,29.2 84.36,27.97 arc(84.35,27.91) 84.32,27.87 ; 86.85,41.85 86.93,41.85 ; 86.93,41.85 88.18,41.85 ; 86.93,41.85 arc(86.91,41.8) 86.88,41.76 ; 86.93,41.85 arc(86.94,41.88) 86.94,41.91 86.94,43.07 ; 85.56,41.76 86.88,41.76 ; 86.88,41.76 86.93,41.76 ; 84.38,37.84 84.38,39.13 arc(84.37,39.19) 84.34,39.23 ; 85.63,44.32 84.35,44.32 arc(84.34,44.34) 84.33,44.37 84.33,45.62 ; 84.36,31.6 84.36,31.57 ; 84.36,31.57 84.36,29.23 arc(84.35,29.18) 84.32,29.13 ; 84.36,31.57 84.41,31.57 arc(84.47,31.56) 84.51,31.53 ; 84.36,31.57 83.15,31.57 ; 89.47,41.85 89.47,43 arc(89.46,43.04) 89.44,43.07 ; 83.11,43.06 86.85,43.06 arc(86.9,43.07) 86.95,43.1 ; 86.88,27.76 85.65,27.76 ; 85.65,27.76 85.63,27.76 ; 85.65,27.76 arc(85.65,27.76) 85.66,27.75 ; 85.65,27.76 arc(85.64,27.78) 85.64,27.8 85.64,31.64 ; 85.63,27.76 84.36,27.76 ; 85.63,27.76 85.63,25.36 arc(85.62,25.3) 85.58,25.25 ; 85.63,27.76 85.63,27.8 ; 84.36,27.76 83.14,27.76 arc(83.09,27.77) 83.04,27.8 ; 84.36,27.76 84.36,25.27 arc(84.36,25.26) 84.36,25.24 arc(84.38,25.18) 84.42,25.12 ; 81.77,29.1 81.79,29.08 82.95,27.92 arc(82.98,27.88) 82.99,27.84 ; 85.64,44.3 85.64,43.16 arc(85.64,43.14) 85.62,43.11 ; 83.78,41.1 84.37,41.69 arc(84.37,41.69) 84.37,41.7 ; 85.61,45.58 84.41,45.58 arc(84.39,45.58) 84.36,45.6 ; 84.37,41.7 84.37,39.32 arc(84.36,39.27) 84.33,39.22 ; 84.37,41.7 arc(84.39,41.72) 84.4,41.75 arc(84.4,41.76) 84.4,41.78 ; 88.18,41.85 88.18,41.88 ; 88.18,41.85 89.45,41.85 arc(89.47,41.84) 89.48,41.84 ; 88.18,41.85 88.18,40.72 arc(88.16,40.63) 88.11,40.55 ; 90.77,41.83 90.77,40.52 arc(90.76,40.47) 90.72,40.42 ; 79.26,41.76 81.8,41.76 arc(81.84,41.77) 81.87,41.79
  Top Layer w0.5: 41.64,3.14 41.64,5.37 arc(41.75,5.94) v1(42.07,6.42) ; 54.66,3.37 54.66,5.67 arc(54.74,6.09) v1(54.98,6.45) ; 69.6,3.54 69.6,5.56 arc(69.51,6.04) v1(69.23,6.45) ; 79.22,73.53 90.45,73.53 arc(90.59,73.56) 90.7,73.64 ; 48.67,3.12 48.67,5.22 arc(48.54,5.88) v1(48.16,6.45) ; 30.64,3.5 30.64,5.66 arc(30.56,6.02) v1(30.36,6.33) ; 86.93,48.12 86.93,46.87 arc(86.92,46.81) 86.89,46.77 ; 86.93,48.12 90.77,48.12 ; 86.93,48.12 83.1,48.12 ; 86.93,48.12 86.93,48.2 ; 79.3,58.29 90.67,58.29 arc(90.7,58.29) 90.73,58.31 ; 26.66,3.37 26.66,5.73 arc(26.6,6.05) v1(26.41,6.33) ; 84.36,26.58 84.39,26.53 84.37,26.53 arc(84.36,26.53) 84.36,26.53 arc(84.35,26.53) 84.35,26.52 ; 89.35,32.98 89.35,32.93 arc(89.39,32.92) 89.43,32.89 arc(89.44,32.89) 89.45,32.88 arc(89.45,32.88) 89.45,32.88 ; 84.37,41.79 84.35,41.78 ; 84.35,41.78 84.35,41.75 84.4,41.75 arc(84.41,41.75) 84.42,41.74 ; 84.35,41.78 arc(84.36,41.77) 84.37,41.77 arc(84.38,41.76) 84.39,41.76 ; 6.68,3.14 v1(6.68,6.22) ; 58.68,3.34 58.68,5.78 arc(58.75,6.13) v1(58.94,6.42) ; 84.42,30.31 84.42,30.36 84.36,30.36 ; 62.67,3.45 62.67,5.73 arc(62.74,6.09) v1(62.95,6.4) ; 70.67,3.5 70.67,5.78 arc(70.74,6.14) v1(70.95,6.45) ; 33.67,3.26 33.67,6.3 arc(33.67,6.32) v1(33.68,6.34) ; 84.4,45.64 84.4,45.61 84.37,45.61 ; 27.65,3.5 27.65,5.67 arc(27.72,6.03) v1(27.93,6.34) ; 37.68,3.48 37.68,5.76 arc(37.75,6.13) v1(37.95,6.43) ; 23.64,3.53 23.64,5.64 arc(23.72,6) v1(23.92,6.31) ; 3.63,3.33 3.63,6.17 arc(3.63,6.19) v1(3.64,6.2) ; 53.64,3.34 53.64,5.78 arc(53.57,6.13) v1(53.38,6.42) ; 73.63,3.56 73.63,5.57 arc(73.53,6.06) v1(73.25,6.47) ; 79.26,50.67 90.65,50.67 arc(90.69,50.66) 90.72,50.64 ; 40.6,3.25 40.6,5.75 arc(40.53,6.11) v1(40.32,6.42) ; 81.81,45.63 80.61,46.83 arc(80.59,46.85) 80.56,46.86 ; 36.66,3.62 36.66,5.78 arc(36.59,6.14) v1(36.39,6.45) ; 80.54,48.18 80.54,46.87 arc(80.54,46.87) 80.54,46.86 ; 78.67,3.54 78.67,5.83 arc(78.74,6.19) v1(78.95,6.5) ; 79.3,69.72 CN1.B36 CN1.C36 CN1.D36 CN1.E36 CN1.F36 CN1.G36 CN1.H36 CN1.J36 90.65,69.72 arc(90.67,69.72) 90.69,69.73 ; 57.64,3.45 57.64,5.84 arc(57.58,6.16) v1(57.4,6.43) ; 90.68,41.86 90.68,41.76 arc(90.7,41.74) 90.72,41.72 ; v1(50.64,6.47) 50.64,4.82 arc(50.64,4.81) 50.65,4.8 ; 81.68,3.35 81.68,5.76 arc(81.6,6.14) v1(81.38,6.47) ; 83.11,46.89 81.89,45.66 arc(81.88,45.65) 81.88,45.63 ; 66.7,3.47 66.7,5.75 arc(66.77,6.11) v1(66.97,6.42) ; 17.67,3.37 17.67,5.27 arc(17.56,5.83) v1(17.24,6.31) ; 79.25,45.62 80.44,46.81 arc(80.48,46.84) 80.54,46.86 ; 45.67,3.25 45.67,5.39 arc(45.78,5.95) v1(46.11,6.43) ; 89.5,46.88 90.64,45.73 arc(90.7,45.65) 90.72,45.56 ; 77.6,3.59 77.6,5.6 arc(77.5,6.09) v1(77.23,6.5) ; 83.1,48.14 83.1,47.02 arc(83.11,46.95) 83.14,46.9 ; 83.08,34.15 83.11,34.15 83.11,34.17 ; 22.64,3.76 22.64,5.68 arc(22.57,6.02) v1(22.38,6.31) ; 65.63,3.51 65.63,5.53 arc(65.53,6.01) v1(65.26,6.42) ; 79.3,54.48 CN1.B24 CN1.C24 CN1.D24 CN1.E24 CN1.F24 CN1.G24 CN1.H24 CN1.J24 90.69,54.48 arc(90.7,54.48) 90.71,54.49 ; 79.28,65.9 90.61,65.9 arc(90.67,65.91) 90.72,65.94 ; 14.67,3.34 14.67,5.33 arc(14.56,5.88) v1(14.25,6.34) ; 88.23,45.62 89.34,46.73 arc(89.36,46.76) 89.37,46.8 ; 84.36,27.86 84.36,27.84 arc(84.36,27.83) 84.36,27.83 arc(84.37,27.81) 84.38,27.8 ; 81.81,41.79 81.87,41.79 arc(81.88,41.79) 81.88,41.8 ; 44.61,3.25 44.61,5.84 arc(44.54,6.16) v1(44.36,6.43) ; 19.68,3.51 19.68,6.29 arc(19.68,6.29) v1(19.69,6.3) ; 79.28,62.11 90.64,62.11 arc(90.66,62.1) 90.68,62.09 ; 61.6,3.49 61.6,5.51 arc(61.51,5.99) v1(61.23,6.4) ; 74.69,3.51 74.69,5.8 arc(74.76,6.16) v1(74.97,6.47) ; 86.94,46.82 88.1,45.66 arc(88.1,45.66) 88.11,45.66 ; 80.54,46.86 arc(80.54,46.86) 80.55,46.86 ; 80.54,46.86 arc(80.53,46.85) 80.52,46.84 ; 85.6,31.66 arc(85.61,31.65) 85.62,31.63 85.62,31.63 arc(85.61,31.62) 85.6,31.61 ; 86.83,37.96 arc(86.84,37.96) 86.85,37.96 arc(86.88,37.95) 86.9,37.93 ; 83.09,32.87 arc(83.1,32.88) 83.11,32.88 ; 83.11,31.66 arc(83.12,31.64) 83.13,31.63
  Bottom Layer w0.14: 83.65,4.67 83.65,5.96 arc(83.61,6.17) 83.48,6.35 83.38,6.46
  Bottom Layer w0.5: 42.67,3.92 42.67,4.96 arc(42.52,5.76) 42.07,6.43 ; 56.65,4.42 56.65,4.63 arc(56.84,5.6) 57.39,6.42 ; 75.63,4.23 75.63,4.9 arc(75.46,5.74) 74.98,6.46 ; 13.59,3.55 13.59,4.71 arc(13.76,5.59) 14.26,6.34 ; 67.66,4.09 67.66,4.77 arc(67.48,5.66) 66.98,6.41 ; 64.66,4.26 64.66,4.96 arc(64.81,5.74) 65.26,6.4 ; 24.63,3.37 24.63,4.61 arc(24.45,5.53) 23.93,6.31 ; 60.62,4.25 60.62,4.9 arc(60.78,5.71) 61.24,6.39 ; 21.72,3.34 21.72,4.74 arc(21.89,5.59) 22.37,6.31 ; 80.62,4.37 80.62,4.67 arc(80.82,5.64) 81.37,6.47 81.38,6.47 ; 25.64,4.22 25.64,4.51 arc(25.84,5.49) 26.39,6.31 26.4,6.32 ; 59.66,4.14 59.66,4.73 arc(59.48,5.65) 58.96,6.42 ; 28.63,3.37 28.63,4.7 arc(28.45,5.59) 27.95,6.35 ; 68.67,3.58 68.67,5.04 arc(68.82,5.81) 69.26,6.46 ; 63.63,4.14 63.63,4.78 arc(63.45,5.66) 62.96,6.4 ; 47.63,4.09 47.63,5.12 arc(47.78,5.84) 48.18,6.44 ; 16.59,3.65 16.59,4.75 arc(16.76,5.6) 17.24,6.32 ; 79.64,4.17 79.64,4.87 arc(79.46,5.77) 78.95,6.54 ; v1(19.69,6.3) 19.69,4.63 arc(19.68,4.57) 19.65,4.53 ; 46.62,3.85 46.62,5.21 arc(46.49,5.87) 46.12,6.43 ; 29.67,3.56 29.67,4.65 arc(29.85,5.55) 30.36,6.31 ; 43.62,3.79 43.62,4.78 arc(43.8,5.68) 44.31,6.44 ; 39.62,4 39.62,4.78 arc(39.8,5.67) 40.3,6.42 ; 52.67,4 52.67,4.72 arc(52.85,5.63) 53.36,6.39 ; 72.65,4.2 72.65,4.97 arc(72.81,5.78) 73.27,6.46 ; 38.61,3.57 38.61,4.86 arc(38.44,5.71) 37.96,6.43 ; 50.67,4.09 50.67,6.39 arc(50.66,6.43) v1(50.64,6.47) ; 32.67,3.38 32.67,6.31 arc(32.67,6.33) v1(32.68,6.34) ; 35.65,3.57 35.65,4.75 arc(35.83,5.67) 36.35,6.44 ; 76.62,4.32 76.62,5.09 arc(76.77,5.84) 77.19,6.46 ; 3.63,6.21 3.63,4.4 ; 71.65,4.12 71.65,4.74 arc(71.46,5.68) 70.93,6.48 ; 55.66,4.12 55.66,4.88 arc(55.48,5.75) 54.99,6.49
  vias: v1(48.41,70.39) v1(48.42,69.52) v1(48.86,97.12) v1(48.87,96.25) v1(49.64,70.39) v1(49.64,69.53) v1(50.08,97.12) v1(50.09,96.26) v1(50.83,70.38) v1(50.84,69.51) v1(51.28,97.11) v1(51.29,96.24) v2(5.34,97.26) v2(5.34,92.18) v2(5.34,87.1) v2(5.34,82.02) v2(5.34,76.94) v2(5.34,71.86) v2(5.34,66.78) v2(5.34,61.7) v2(5.34,56.62) v2(5.34,51.54) v2(5.34,46.46) v2(5.34,41.38) v2(5.34,31.22) v2(5.34,26.14) v2(5.34,21.06) v2(5.34,15.98) v2(10.42,87.1) v2(10.42,82.02) v2(10.42,76.94) v2(10.42,71.86) v2(10.42,66.78) v2(10.42,61.7) v2(10.42,56.62) v2(10.42,51.54) v2(10.42,46.46) v2(10.42,36.3) v2(10.42,31.22) v2(15.5,97.26) v2(15.5,87.1) v2(15.5,82.02) v2(15.5,76.94) v2(15.5,71.86) v2(15.5,66.78) v2(15.5,61.7) v2(15.5,56.62) v2(15.5,51.54) v2(15.5,41.38) v2(15.5,36.3) v2(15.5,31.22) v2(15.5,26.14) v2(20.58,97.26) v2(20.58,76.94) v2(20.58,71.86) v2(20.58,66.78) v2(20.58,61.7) v2(20.58,56.62) v2(20.58,46.46) v2(20.58,41.38) v2(20.58,36.3) v2(20.58,31.22) v2(20.58,26.14) v2(20.58,21.06) v2(20.58,10.9) v2(24.51,27.36) v2(25.66,97.26) v2(25.66,92.18) v2(25.66,87.1) v2(25.66,82.02) v2(25.66,76.94) v2(25.66,71.86) v2(25.66,66.78) v2(25.66,61.7) v2(25.66,56.62) v2(25.66,51.54) v2(25.66,46.46) v2(25.66,41.38) v2(25.66,36.3) v2(25.66,31.22) v2(25.66,26.14) v2(25.66,21.06) v2(26.97,20.07) v2(28.96,32.1) v2(30.74,97.26) v2(30.74,92.18) v2(30.74,87.1) v2(30.74,82.02) v2(30.74,76.94) v2(30.74,71.86) v2(30.74,66.78) v2(30.74,61.7) v2(30.74,56.62) v2(30.74,51.54) v2(30.74,46.46) v2(30.74,41.38) v2(30.74,36.3) v2(30.74,31.22) v2(30.74,26.14) v2(33.23,25.96) v2(34.02,37.04) v2(35.82,92.18) v2(35.82,87.1) v2(35.82,82.02) v2(35.82,76.94) v2(35.82,66.78) v2(35.82,61.7) v2(35.82,56.62) v2(35.82,51.54) v2(35.82,46.46) v2(35.82,41.38) v2(35.82,36.3) v2(35.82,31.22) v2(35.82,15.98) v2(36.24,25.01) v2(37.75,24.22) v2(37.9,30.84) v2(40.9,92.18) v2(40.9,87.1) v2(40.9,82.02) v2(40.9,76.94) v2(40.9,66.78) v2(40.9,61.7) v2(40.9,56.62) v2(40.9,51.54) v2(40.9,46.46) v2(40.9,36.3) v2(40.9,21.06) v2(41.89,30.76) v2(42.72,19.03) v2(43.62,36.17) v2(43.64,30.08) v2(45.98,97.26) v2(45.98,92.18) v2(45.98,87.1) v2(45.98,82.02) v2(45.98,76.94) v2(45.98,71.86) v2(45.98,66.78) v2(45.98,61.7) v2(45.98,56.62) v2(45.98,51.54) v2(45.98,46.46) v2(45.98,26.14) v2(45.98,15.98) v2(47.13,35.85) v2(47.43,23.52) v2(49.4,35.78) v2(49.94,22.11) v2(51.06,92.18) v2(51.06,87.1) v2(51.06,82.02) v2(51.06,76.94) v2(51.06,66.78) v2(51.06,61.7) v2(51.06,56.62) v2(51.06,51.54) v2(51.06,46.46) v2(51.06,31.22) v2(51.06,21.06) v2(51.06,15.98) v2(51.06,10.9) v2(52.48,20.35) v2(53.7,30.05) v2(56.14,97.26) v2(56.14,92.18) v2(56.14,87.1) v2(56.14,82.02) v2(56.14,76.94) v2(56.14,71.86) v2(56.14,66.78) v2(56.14,61.7) v2(56.14,56.62) v2(56.14,51.54) v2(56.14,46.46) v2(56.14,36.3) v2(56.14,26.14) v2(56.14,15.98) v2(56.14,10.9) v2(57.56,25.46) v2(57.85,30.01) v2(59.16,24.68) v2(60.39,23.9) v2(61.22,87.1) v2(61.22,82.02) v2(61.22,76.94) v2(61.22,71.86) v2(61.22,66.78) v2(61.22,61.7) v2(61.22,56.62) v2(61.22,51.54) v2(61.22,46.46) v2(61.22,31.22) v2(61.22,21.06) v2(62.77,30.53) v2(62.81,20.05) v2(64.91,17.9) v2(65.27,30.76) v2(66.3,87.1) v2(66.3,82.02) v2(66.3,76.94) v2(66.3,71.86) v2(66.3,66.78) v2(66.3,61.7) v2(66.3,56.62) v2(66.3,51.54) v2(66.3,46.46) v2(66.3,26.14) v2(66.41,30.04) v2(67.99,25.11) v2(68.85,17.97) v2(70.56,23.59) v2(71.38,87.1) v2(71.38,82.02) v2(71.38,76.94) v2(71.38,71.86) v2(71.38,66.78) v2(71.38,61.7) v2(71.38,56.62) v2(71.38,51.54) v2(71.38,46.46) v2(71.38,31.22) v2(71.38,15.98) v2(71.38,10.9) v2(73.59,30.92) v2(73.73,19.26) v2(75.52,17.06) v2(75.75,28.7) v2(75.76,24.85) v2(76.46,97.26) v2(76.46,92.18) v2(76.46,87.1) v2(76.46,82.02) v2(76.46,76.94) v2(76.46,71.86) v2(76.46,66.78) v2(76.46,61.7) v2(76.46,56.62) v2(76.46,51.54) v2(76.87,17.15) v2(77.74,23.43) v2(79.28,40.57) v2(81.54,87.1) v2(81.54,82.02) v2(81.54,76.94) v2(81.54,21.06) v2(81.54,15.98) v2(83.59,20.38) v2(83.72,41.12) v2(86.62,87.1) v2(86.62,82.02) v2(86.62,76.94) v2(86.57,19.95) v2(86.62,10.9) v2(91.7,92.18) v2(91.7,87.1) v2(91.7,82.02) v2(91.7,76.94) v2(91.7,71.86) v2(91.7,66.78) v2(91.7,61.7) v2(91.7,56.62) v2(91.7,51.54) v2(91.7,46.46) v2(91.7,36.3) v2(91.7,31.22) v2(91.7,21.06) v2(91.7,15.98) v2(91.7,10.9) v2(96.78,97.26) v2(96.78,92.18) v2(96.78,87.1) v2(96.78,82.02) v2(96.78,76.94) v2(96.78,71.86) v2(96.78,66.78) v2(96.78,61.7) v2(96.78,56.62) v2(96.78,51.54) v2(96.78,46.46) v2(96.78,41.38) v2(96.78,36.3) v2(96.78,31.22) v2(96.78,26.14) v2(96.78,21.06) v2(96.78,15.98) v3(79.28,73.53) v3(79.27,69.72) v3(79.28,65.91) v3(79.27,62.11) v3(79.28,54.5) v3(79.29,36.73) v3(79.29,29.08) v3(80.55,31.64) v3(82.46,37.32) v3(83.11,50.69) v3(83.09,48.12) v3(83.09,31.63) v3(83.39,6.47) v3(84.37,25.28) v3(85.62,44.33) v3(88.17,29.09) v3(89.44,41.79) v3(90.71,58.3) v3(90.72,54.52) v3(90.72,50.68)
HSIP0_N: length 22.2
  Top Layer w0.138: v2(91.74,27.81) 90.89,27.81 arc(90.88,27.81) 90.87,27.82
  Bottom Layer w0.138: C31.2 81.59,10.69 arc(81.64,10.94) 81.79,11.16 arc(81.93,11.38) 81.98,11.64 81.98,15.78 arc(82.18,16.75) 82.73,17.57 91.2,26.05 arc(91.28,26.16) 91.31,26.3 91.31,26.58 arc(91.36,26.87) 91.52,27.11 91.64,27.22 arc(91.71,27.33) 91.74,27.46 v2(91.74,27.81)
HSIP0_P: length 22.2
  Top Layer w0.138: 90.86,26.45 91.67,26.45 arc(91.71,26.46) v2(91.74,26.48)
  Bottom Layer w0.138: C32.2 82.63,10.69 arc(82.58,10.95) 82.43,11.16 arc(82.28,11.38) 82.23,11.64 82.23,15.78 arc(82.41,16.66) 82.9,17.4 88.33,22.83 arc(88.42,22.87) 88.51,22.83 88.53,22.82 arc(88.71,22.82) 88.71,23 88.69,23.01 arc(88.69,23.19) 88.87,23.19 88.89,23.18 arc(89.07,23.18) 89.06,23.36 89.05,23.37 arc(89.05,23.55) 89.23,23.55 89.24,23.54 arc(89.42,23.54) 89.42,23.72 89.41,23.73 arc(89.41,23.91) 89.59,23.91 89.6,23.9 arc(89.78,23.9) 89.78,24.08 89.77,24.09 arc(89.73,24.18) 89.77,24.27 91.57,26.06 arc(91.69,26.25) v2(91.74,26.48)
HSIP1_N: length 20.6
  Top Layer w0.138: v2(88.81,25.9) 89.24,26.33 arc(89.28,26.36) 89.32,26.36
  Bottom Layer w0.138: 78.73,14.65 88.36,24.28 arc(88.48,24.47) 88.52,24.69 88.52,25.21 arc(88.6,25.58) v2(88.81,25.9) ; C29.2 77.59,10.69 arc(77.64,10.94) 77.79,11.16 arc(77.93,11.37) 77.98,11.63 77.98,12.85 arc(78.17,13.83) 78.72,14.65
HSIP1_P: length 20.6
  Top Layer w0.138: v2(88.94,24.52) 89.44,25.02 arc(89.52,25.13) 89.55,25.27
  Bottom Layer w0.138: C30.2 78.62,10.69 arc(78.56,10.94) 78.42,11.16 arc(78.28,11.37) 78.23,11.63 78.23,12.85 arc(78.4,13.73) 78.9,14.47 80.21,15.78 arc(80.3,15.82) 80.39,15.78 80.47,15.7 arc(80.65,15.7) 80.65,15.88 80.57,15.96 arc(80.56,16.14) 80.74,16.14 80.83,16.05 arc(81.01,16.05) 81.01,16.23 80.92,16.32 arc(80.89,16.41) 80.92,16.5 v2(88.94,24.52)
HSIP2_N: length 21.3
  Top Layer w0.138: 86.92,25.19 86.92,25.18 arc(86.82,24.68) v2(86.54,24.27)
  Bottom Layer w0.138: C28.2 74.63,10.72 arc(74.59,10.95) 74.46,11.14 arc(74.33,11.33) 74.29,11.55 74.29,11.77 arc(74.33,12) 74.46,12.19 81.28,19.01 arc(81.37,19.04) 81.46,19.01 81.58,18.88 arc(81.76,18.88) 81.76,19.06 81.64,19.19 arc(81.64,19.37) 81.82,19.37 81.95,19.24 arc(82.13,19.24) 82.13,19.42 82,19.55 arc(81.96,19.64) 82,19.73 v2(86.54,24.27)
HSIP2_P: length 21.3
  Top Layer w0.138: 86.77,26.45 86.29,25.97 arc(86.27,25.93) v2(86.26,25.89)
  Bottom Layer w0.138: C27.2 73.7,10.72 arc(73.74,10.95) 73.87,11.14 arc(74,11.33) 74.04,11.55 74.04,11.77 arc(74.11,12.09) 74.29,12.36 85.85,23.92 arc(86.03,24.19) 86.09,24.5 86.09,25.48 arc(86.13,25.7) v2(86.26,25.89)
HSIP3_N: length 26.5
  Top Layer w0.138: 88.12,26.39 87.77,26.04 arc(87.63,25.94) v2(87.46,25.91)
  Bottom Layer w0.138: v2(87.46,25.91) 87.03,26.33 arc(87.01,26.35) 86.98,26.36 85.11,26.36 arc(84.23,26.18) 83.49,25.69 78.19,20.38 arc(78.15,20.29) 78.19,20.2 78.27,20.12 arc(78.27,19.94) 78.09,19.94 78.01,20.02 arc(77.92,20.06) 77.83,20.02 70.3,12.49 70.3,11.59 arc(70.35,11.35) 70.48,11.15 arc(70.62,10.95) 70.66,10.71 C26.2
HSIP3_P: length 26.5
  Top Layer w0.138: 88.09,27.78 87.55,27.24 arc(87.52,27.19) v2(87.51,27.14)
  Bottom Layer w0.138: C25.2 69.69,10.71 arc(69.73,10.95) 69.87,11.15 arc(70,11.35) 70.05,11.59 70.05,12.52 arc(70.06,12.59) 70.11,12.65 83.31,25.86 arc(84.14,26.41) 85.11,26.61 86.98,26.61 v2(87.51,27.14)
HSIP4_N: length 34.6
  Top Layer w0.138: 89.71,30.3 89.88,30.13 arc(90.01,29.93) v2(90.06,29.7)
  Bottom Layer w0.138: C23.2 65.71,10.72 arc(65.76,10.95) 65.89,11.14 arc(66.02,11.34) 66.06,11.56 66.06,12.15 arc(66.26,13.12) 66.81,13.95 79.93,27.07 arc(80.76,27.62) 81.73,27.82 88.94,27.82 arc(89.19,27.87) 89.4,28.01 89.48,28.08 arc(89.6,28.27) 89.65,28.5 89.65,28.89 arc(89.73,29.28) 89.95,29.61
HSIP4_P: length 34.6
  Top Layer w0.138: 89.6,29.1 89.94,28.76 arc(90.05,28.6) v2(90.09,28.41)
  Bottom Layer w0.138: v2(90.09,28.41) 90.09,28.27 arc(90.06,28.14) 89.99,28.03 89.86,27.9 arc(89.49,27.65) 89.05,27.57 81.73,27.57 arc(80.85,27.39) 80.11,26.89 71.65,18.43 arc(71.61,18.34) 71.65,18.25 71.71,18.19 arc(71.71,18.01) 71.53,18.01 71.47,18.07 arc(71.29,18.08) 71.29,17.9 71.35,17.84 arc(71.35,17.66) 71.17,17.66 71.11,17.72 arc(71.02,17.75) 70.93,17.72 66.98,13.77 arc(66.48,13.03) 66.31,12.15 66.31,11.56 arc(66.36,11.33) 66.48,11.14 arc(66.61,10.95) 66.66,10.72 C24.2
HSIP5_N: length 34.9
  Top Layer w0.138: 86.94,28.91 86.53,28.49 arc(86.37,28.39) v2(86.19,28.35)
  Bottom Layer w0.138: C22.2 62.67,10.71 arc(62.62,10.95) 62.48,11.15 arc(62.35,11.36) 62.3,11.6 62.3,12.24 arc(62.47,13.12) 62.97,13.86 67.03,17.92 arc(67.12,17.96) 67.21,17.92 67.24,17.89 arc(67.42,17.89) 67.42,18.07 67.39,18.1 arc(67.39,18.28) 67.57,18.28 67.61,18.24 arc(67.79,18.24) 67.79,18.42 67.75,18.46 arc(67.75,18.64) 67.93,18.64 67.97,18.6 arc(68.14,18.6) 68.14,18.78 68.11,18.82 arc(68.07,18.91) 68.11,19 76.79,27.68 arc(77.53,28.17) 78.41,28.35 v2(86.19,28.35)
HSIP5_P: length 34.9
  Top Layer w0.138: 86.8,30.38 86.52,30.1 arc(86.39,29.91) v2(86.35,29.69)
  Bottom Layer w0.138: 85.33,28.6 85.62,28.6 arc(85.82,28.64) 85.98,28.75 arc(86.25,29.15) 86.35,29.64 v2(86.35,29.69) ; 85.33,28.6 78.41,28.6 ; 85.33,28.6 85.33,28.6 ; C21.2 61.68,10.7 arc(61.73,10.94) 61.87,11.15 arc(62,11.35) 62.05,11.59 62.05,12.24 arc(62.24,13.21) 62.79,14.03 76.61,27.85 arc(77.44,28.4) 78.41,28.59
HSIP6_N: length 40.9
  Top Layer w0.138: 88.26,30.49 88.2,30.55 arc(87.9,30.78) v2(87.53,30.85)
  Bottom Layer w0.138: C20.2 58.61,10.71 arc(58.56,10.95) 58.43,11.15 arc(58.29,11.36) 58.24,11.6 58.24,12.14 arc(58.42,13.02) 58.91,13.76 64.98,19.83 arc(65.07,19.87) 65.16,19.83 65.19,19.8 arc(65.37,19.8) 65.37,19.98 65.34,20.01 arc(65.34,20.19) 65.52,20.19 65.59,20.11 arc(65.77,20.11) 65.77,20.29 65.7,20.37 arc(65.66,20.46) 65.7,20.55 75.34,30.19 arc(76.09,30.69) 76.96,30.86 87.52,30.86
HSIP6_P: length 40.9
  Top Layer w0.138: 88.27,31.78 88.09,31.96 arc(87.8,32.15) v2(87.46,32.22)
  Bottom Layer w0.138: C19.2 57.62,10.71 arc(57.67,10.95) 57.81,11.15 arc(57.95,11.36) 57.99,11.6 57.99,12.14 arc(58.19,13.11) 58.74,13.94 75.17,30.37 arc(75.99,30.92) 76.96,31.11 86.08,31.11 arc(86.33,31.16) 86.55,31.3 v2(87.46,32.22)
HSIP7_N: length 51.4
  Top Layer w0.138: v2(90.04,32.21) 90.59,31.66 arc(90.68,31.6) 90.79,31.58
  Bottom Layer w0.138: C17.2 53.59,10.71 arc(53.64,10.95) 53.78,11.15 arc(53.91,11.36) 53.96,11.6 53.96,17.73 arc(54.15,18.7) 54.71,19.52 67.47,32.29 arc(68.29,32.84) 69.26,33.03 88.18,33.03 arc(89.15,32.84) 89.97,32.29 v2(90.04,32.21)
HSIP7_P: length 51.5
  Top Layer w0.138: v2(89.98,30.97) 90.53,30.43 arc(90.61,30.37) 90.7,30.36
  Bottom Layer w0.138: v2(89.98,30.97) 88.33,32.62 arc(88.16,32.74) 87.95,32.78 69.26,32.78 arc(68.39,32.6) 67.64,32.11 54.88,19.35 arc(54.38,18.6) 54.21,17.73 54.21,11.6 arc(54.26,11.35) 54.39,11.15 arc(54.53,10.94) 54.58,10.7 C18.2
HSIP8_N: length 56.4
  Top Layer w0.138: v2(90.06,34.78) 90.63,35.35 arc(90.65,35.37) 90.67,35.37
  Bottom Layer w0.138: C15.2 48.59,10.68 arc(48.64,10.94) 48.79,11.16 arc(48.94,11.38) 48.99,11.64 48.99,17.22 arc(49.18,18.19) 49.73,19.02 63.65,32.94 arc(64.48,33.49) 65.45,33.68 87.91,33.68 arc(88.88,33.88) 89.71,34.43 v2(90.06,34.78)
HSIP8_P: length 56.4
  Top Layer w0.138: v2(90.06,33.44) 90.56,33.93 arc(90.6,33.99) 90.61,34.07
  Bottom Layer w0.138: C16.2 49.63,10.69 arc(49.58,10.95) 49.44,11.17 arc(49.29,11.39) 49.24,11.65 49.24,17.22 arc(49.41,18.1) 49.91,18.84 54.37,23.3 arc(54.46,23.34) 54.55,23.3 54.71,23.15 arc(54.89,23.15) 54.89,23.32 54.73,23.48 arc(54.69,23.57) 54.73,23.66 63.83,32.76 arc(64.57,33.26) 65.45,33.44 v2(90.06,33.44)
HSIP9_N: length 58.9
  Top Layer w0.138: 89.36,36.75 88.91,36.3 arc(88.83,36.17) v2(88.8,36.02)
  Bottom Layer w0.138: C13.2 44.62,10.7 arc(44.66,10.95) 44.81,11.16 arc(44.95,11.37) 45,11.62 45,15.4 arc(45.19,16.37) 45.74,17.2 61.99,33.45 arc(62.82,34) 63.79,34.19 87.04,34.19 arc(87.4,34.26) 87.7,34.46 88.47,35.24 arc(88.71,35.6) v2(88.8,36.02)
HSIP9_P: length 58.9
  Top Layer w0.138: v2(88.75,34.74) 89.37,35.35 arc(89.39,35.38) 89.4,35.42
  Bottom Layer w0.138: v2(88.75,34.74) 88.42,34.4 arc(87.91,34.06) 87.31,33.94 63.79,33.94 arc(62.91,33.77) 62.17,33.27 54.59,25.7 arc(54.56,25.61) 54.59,25.52 54.63,25.48 arc(54.63,25.3) 54.45,25.3 54.41,25.34 arc(54.23,25.34) 54.23,25.16 54.27,25.12 arc(54.27,24.94) 54.09,24.94 54.05,24.98 arc(53.87,24.98) 53.87,24.8 ; C14.2 45.63,10.7 arc(45.58,10.95) 45.44,11.16 arc(45.29,11.37) 45.25,11.62 45.25,15.4 arc(45.42,16.28) 45.92,17.02 53.51,24.62 arc(53.6,24.66) 53.69,24.62 ; 53.88,24.8 arc(53.88,24.62) 53.7,24.62
HSIP10_N: length 60.7
  Top Layer w0.138: 88.21,34.37 88.04,34.53 arc(87.74,34.73) v2(87.38,34.8)
  Bottom Layer w0.138: C12.2 41.58,10.7 arc(41.54,10.94) 41.4,11.15 arc(41.26,11.35) 41.21,11.6 41.21,14.07 arc(41.39,14.94) 41.89,15.69 52.42,26.22 arc(52.51,26.26) 52.6,26.22 52.64,26.19 arc(52.82,26.19) 52.82,26.37 52.78,26.4 arc(52.78,26.58) 52.96,26.58 53.02,26.53 arc(53.2,26.53) 53.2,26.71 53.14,26.76 arc(53.11,26.85) 53.14,26.94 60.33,34.13 arc(61.08,34.63) 61.95,34.8 v2(87.38,34.8)
HSIP10_P: length 60.7
  Top Layer w0.138: 88.25,35.6 88.01,35.85 arc(87.77,36.01) v2(87.48,36.06)
  Bottom Layer w0.138: v2(87.48,36.06) 86.66,35.25 arc(86.44,35.1) 86.19,35.05 61.95,35.05 arc(60.98,34.86) 60.16,34.31 41.71,15.86 arc(41.16,15.04) 40.97,14.07 40.97,11.6 arc(40.92,11.35) 40.78,11.15 arc(40.64,10.94) 40.6,10.7 C11.2
HSIP11_N: length 63.7
  Top Layer w0.138: 86.91,35.57 86.64,35.83 arc(86.42,35.98) v2(86.16,36.03)
  Bottom Layer w0.138: C10.2 37.6,10.69 arc(37.55,10.95) 37.4,11.16 arc(37.26,11.38) 37.21,11.63 37.21,13.49 arc(37.38,14.37) 37.88,15.11 47.18,24.42 arc(47.27,24.45) 47.36,24.42 47.43,24.35 arc(47.61,24.35) 47.61,24.53 47.54,24.6 arc(47.54,24.78) 47.72,24.78 47.8,24.7 arc(47.98,24.7) 47.98,24.88 47.9,24.96 arc(47.87,25.05) 47.9,25.14 58.13,35.36 arc(58.87,35.86) 59.75,36.03 v2(86.16,36.03)
HSIP11_P: length 63.7
  Top Layer w0.138: 87.03,36.82 86.7,37.14 arc(86.46,37.31) v2(86.17,37.36)
  Bottom Layer w0.138: C9.2 36.57,10.69 arc(36.62,10.95) 36.77,11.16 arc(36.91,11.38) 36.96,11.63 36.96,13.49 arc(37.15,14.46) 37.71,15.29 57.96,35.54 arc(58.78,36.09) 59.75,36.28 84.83,36.28 arc(85.07,36.33) 85.28,36.47 v2(86.17,37.36)
HSIP12_N: length 76.4
  Top Layer w0.138: 90.62,39.22 90.07,38.67 arc(90.02,38.64) v2(89.96,38.62)
  Bottom Layer w0.138: v2(89.96,38.62) 89.59,38.26 arc(89.41,38.14) 89.21,38.1 51.18,38.1 arc(50.21,37.91) 49.39,37.35 31.74,19.7 arc(31.19,18.88) 30.99,17.91 30.99,11.6 arc(30.95,11.36) 30.81,11.15 arc(30.67,10.95) 30.62,10.71 C7.2
HSIP12_P: length 76.4
  Top Layer w0.138: 90.68,37.86 90.23,37.41 arc(90.13,37.34) v2(90,37.32)
  Bottom Layer w0.138: C8.2 31.61,10.71 arc(31.56,10.95) 31.43,11.15 arc(31.29,11.36) 31.24,11.6 31.24,17.91 arc(31.42,18.79) 31.91,19.53 35.72,23.34 arc(35.81,23.38) 35.9,23.34 35.93,23.31 arc(36.11,23.31) 36.11,23.49 36.08,23.52 arc(36.04,23.61) 36.08,23.7 49.56,37.18 arc(50.31,37.68) 51.18,37.85 89.09,37.85 arc(89.44,37.78) 89.74,37.58 v2(90,37.32)
HSIP13_N: length 77.3
  Top Layer w0.138: 88.13,38.1 87.78,38.45 arc(87.63,38.55) v2(87.46,38.58)
  Bottom Layer w0.138: C6.2 27.61,10.7 arc(27.56,10.94) 27.42,11.15 arc(27.28,11.36) 27.23,11.61 27.23,15.93 arc(27.4,16.81) 27.9,17.55 40.09,29.74 arc(40.18,29.78) 40.27,29.74 40.31,29.7 arc(40.49,29.7) 40.49,29.88 40.45,29.92 arc(40.45,30.1) 40.63,30.1 40.68,30.05 arc(40.86,30.05) 40.86,30.23 40.81,30.28 arc(40.77,30.37) 40.81,30.46 48.26,37.91 arc(49.01,38.41) 49.88,38.58 v2(87.46,38.58)
